# EAGLE design MySens-GWeasyRS485-Nano-V20-011 (EAGLE 7.6.0)
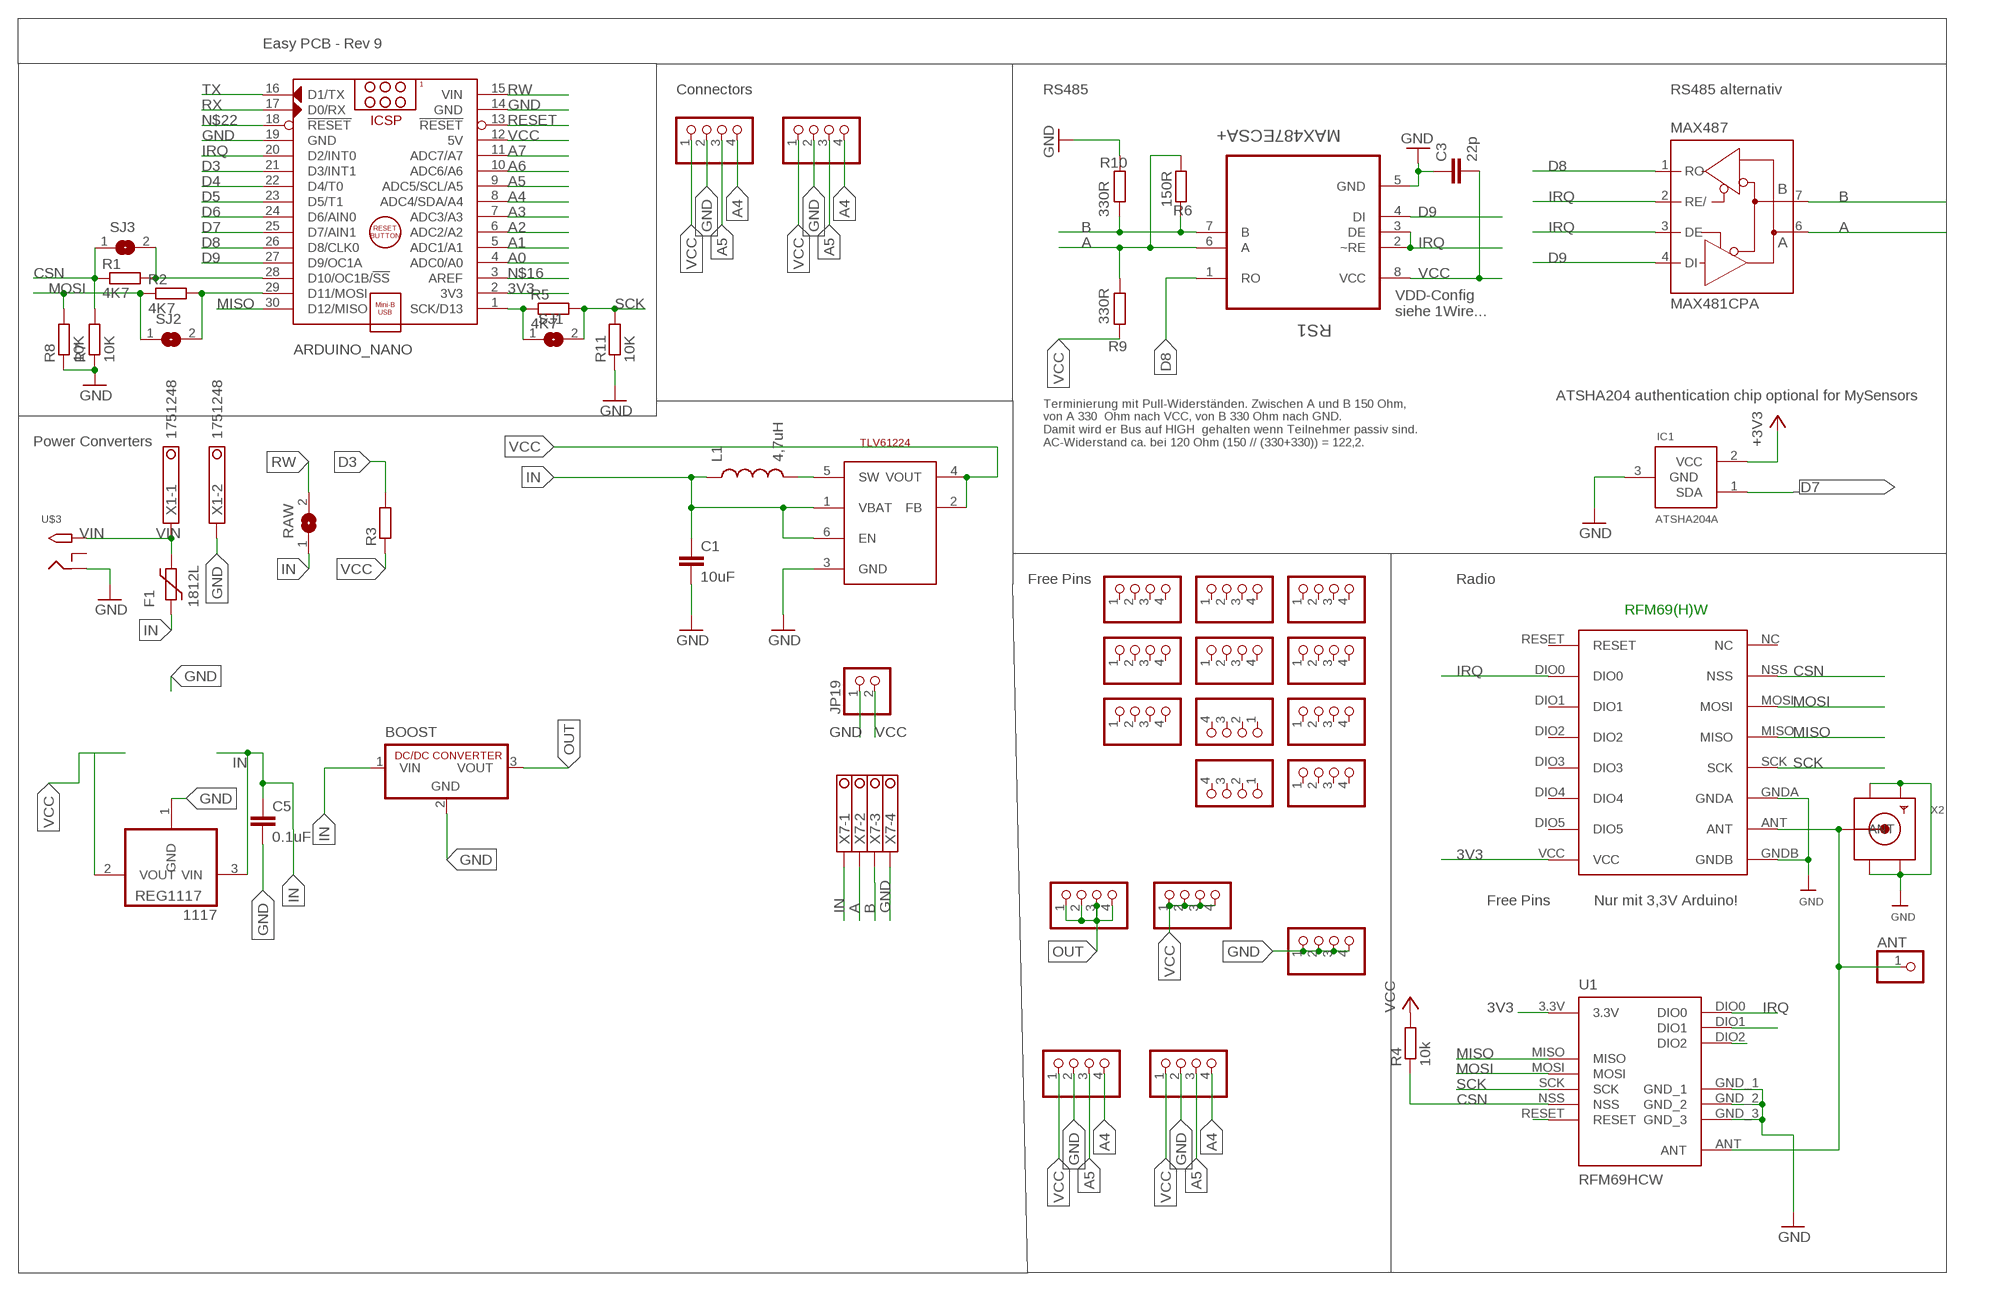
[diagram p0: schematic, sheet 1]

## Parts
1117  REG1117  [SOT223]
ANT  PINHD-1X1  [1X01]
ARDUINO_NANO  ARDUINO_NANO_OHNE-BOHR  [ARDUINO_NANO]
BOOST  R-78C1.8-1.0  [SIP3]
C1  10uF  CAP0805  [0805]
C3  22p  C-EUC0805  [C0805]
C5  0.1uF  C-EUC1206  [C1206]
F1  1812L  [1812L]
IC1  ATSHA204A  [SOT23]
JP1  PINHD-1X04_2.54-S  [1X04-S]
JP2  PINHD-1X04_2.54-S  [1X04-S]
JP3  PINHD-1X04_2.54-S  [1X04-S]
JP4  PINHD-1X04_2.54-S  [1X04-S]
JP5  PINHD-1X04_2.54-S  [1X04-S]
JP6  PINHD-1X04_2.54-S  [1X04-S]
JP7  PINHD-1X04_2.54-S  [1X04-S]
JP8  PINHD-1X04_2.54-S  [1X04-S]
JP9  PINHD-1X04_2.54-S  [1X04-S]
JP10  PINHD-1X04_2.54-S  [1X04-S]
JP11  PINHD-1X04_2.54-S  [1X04-S]
JP12  PINHD-1X04_2.54-S  [1X04-S]
JP13  PINHD-1X04_2.54-S  [1X04-S]
JP14  PINHD-1X04_2.54-S  [1X04-S]
JP15  PINHD-1X04_2.54-S  [1X04-S]
JP16  PINHD-1X04_2.54-S  [1X04-S]
JP17  PINHD-1X04_2.54-S  [1X04-S]
JP18  PINHD-1X04_2.54-S  [1X04-S]
JP19  PINHD-1X2  [1X02]
L1  4,7uH  INDUCTOR0805  [0805]
MAX487  MAX481CPA  [DIL08]
R1  4K7  R-EU_M0805  [M0805]
R2  4K7  R-EU_M0805  [M0805]
R3  R-EU_R0805  [R0805]
R4  10k  R-EU_M0805  [M0805]
R5  4K7  R-EU_M0805  [M0805]
R6  150R  R-EU_R0805  [R0805]
R7  10K  R-EU_M0805  [M0805]
R8  10K  R-EU_M0805  [M0805]
R9  330R  R-EU_R0805  [R0805]
R10  330R  R-EU_R0805  [R0805]
R11  10K  R-EU_M0805  [M0805]
RAW  SJ  [SJ]
RFM69W  RFM69HW  [RFM]
RS1  MAX487ECSA+  [SOIC127P600X175-8N]
SJ1  SJ  [SJ]
SJ2  SJ  [SJ]
SJ3  SJ  [SJ]
STEPUP  TLV61224  TI-TLV61224  [SOT23-6L]
U1  RFM69HCW  [RFM69HCW-XXXS2]
U$3  2.1MMJACKTHM  [PJ-102A]
X1  1751248  [1751248]
X2  SMACONNECTOR_EDGE  [SMA_EDGELAUNCH]
X7  1751264  [1751264]

## Nets
3V3: ARDUINO_NANO.2(3V3) IC1.2(VCC) RFM69W.VCC U1.3.3V ; supply symbol labelled +3V3
A: MAX487.6(A) R6.1 R9.2 RS1.6(A) X7.2
A0: ARDUINO_NANO.4(ADC0/A0)
A1: ARDUINO_NANO.5(ADC1/A1)
A2: ARDUINO_NANO.6(ADC2/A2)
A3: ARDUINO_NANO.7(ADC3/A3)
A4: ARDUINO_NANO.8(ADC4/SDA/A4) JP6.4 JP10.4 JP17.4 JP18.4
A5: ARDUINO_NANO.9(ADC5/SCL/A5) JP6.3 JP10.3 JP17.3 JP18.3
A6: ARDUINO_NANO.10(ADC6/A6)
A7: ARDUINO_NANO.11(ADC7/A7)
ANT: ANT.1 RFM69W.ANT U1.ANT X2.P(ANT)
B: MAX487.7(B) R6.2 R10.1 RS1.7(B) X7.3
CSN: R1.1 R4.1 R7.2 RFM69W.NSS SJ3.1 U1.NSS
D3: ARDUINO_NANO.21(D3/INT1) R3.2
D4: ARDUINO_NANO.22(D4/T0)
D5: ARDUINO_NANO.23(D5/T1)
D6: ARDUINO_NANO.24(D6/AIN0)
D7: ARDUINO_NANO.25(D7/AIN1) IC1.1(SDA)
D8: ARDUINO_NANO.26(D8/CLK0) MAX487.1(RO) RS1.1(RO)
D9: ARDUINO_NANO.27(D9/OC1A) MAX487.4(DI) RS1.4(DI)
GND [Power]: 1117.1(GND) ARDUINO_NANO.14(GND) ARDUINO_NANO.19(GND) BOOST.2(GND) C1.2 C3.1 C5.2 IC1.3(GND) JP1.1 JP1.2 JP1.3 JP1.4 JP6.2 JP10.2 JP17.2 JP18.2 JP19.1 R7.1 R8.1 R10.2 R11.1 RFM69W.GNDA RFM69W.GNDB RS1.5(GND) STEPUP.3(GND) U1.GND_1 U1.GND_2 U1.GND_3 U$3.RING X1.2 X2.GND@1(GND4) X2.GND@2(GND3) X2.GND@3(GND2) X2.GND@4(GND1) X7.4
IN [Power]: 1117.3(VIN) BOOST.1(VIN) C1.1 C5.1 F1.P$1 L1.1 RAW.1 STEPUP.1(VBAT) STEPUP.6(EN) X7.1
IRQ: ARDUINO_NANO.20(D2/INT0) MAX487.2(RE/) MAX487.3(DE) RFM69W.DIO0 RS1.2(~RE) RS1.3(DE) U1.DIO0
MISO: ARDUINO_NANO.30(D12/MISO) RFM69W.MISO U1.MISO
MOSI: R2.1 R8.2 RFM69W.MOSI SJ2.1 U1.MOSI
N$1: U1.RESET
N$2: ARDUINO_NANO.1(SCK/D13) R5.1 SJ1.1
N$3: ARDUINO_NANO.28(D10/OC1B/!SS) R1.2 SJ3.2
N$4: ARDUINO_NANO.29(D11/MOSI) R2.2 SJ2.2
N$13: L1.2 STEPUP.5(SW)
N$14: U1.DIO2
N$15: U1.DIO1
N$16: ARDUINO_NANO.3(AREF)
N$22: ARDUINO_NANO.18(!RESET)
OUT [Power]: BOOST.3(VOUT) JP13.1 JP13.2 JP13.3 JP13.4
RESET: ARDUINO_NANO.13(!RESET)
RW: ARDUINO_NANO.15(VIN) RAW.2
RX: ARDUINO_NANO.17(D0/RX)
SCK: R5.2 R11.2 RFM69W.SCK SJ1.2 U1.SCK
TX: ARDUINO_NANO.16(D1/TX)
VCC [Power]: 1117.2(VOUT) ARDUINO_NANO.12(5V) C3.2 JP3.1 JP3.2 JP3.3 JP3.4 JP6.1 JP10.1 JP17.1 JP18.1 JP19.2 R3.1 R4.2 R9.1 RS1.8(VCC) STEPUP.2(FB) STEPUP.4(VOUT)
VIN [Power]: F1.P$2 U$3.TIP X1.1
Unconnected: JP2.1 JP2.2 JP2.3 JP2.4 JP4.1 JP4.2 JP4.3 JP4.4 JP5.1 JP5.2 JP5.3 JP5.4 JP7.1 JP7.2 JP7.3 JP7.4 JP8.1 JP8.2 JP8.3 JP8.4 JP9.1 JP9.2 JP9.3 JP9.4 JP11.1 JP11.2 JP11.3 JP11.4 JP12.1 JP12.2 JP12.3 JP12.4 JP14.1 JP14.2 JP14.3 JP14.4 JP15.1 JP15.2 JP15.3 JP15.4 JP16.1 JP16.2 JP16.3 JP16.4 RFM69W.DIO1 RFM69W.DIO2 RFM69W.DIO3 RFM69W.DIO4 RFM69W.DIO5 RFM69W.NC RFM69W.RESET U$3.RING_SW

## Notes on the sheet
- Easy PCB - Rev 9
- Connectors | RS485 | RS485 alternativ
- VDD-Config
  siehe 1Wire...
- ATSHA204 authentication chip optional for MySensors
- Power Converters
- Terminierung mit Pull-Widerständen. Zwischen A und B 150 Ohm,
  von A 330  Ohm nach VCC, von B 330 Ohm nach GND. 
  Damit wird er Bus auf HIGH  gehalten wenn Teilnehmer passiv sind.
  AC-Widerstand ca. bei 120 Ohm (150 // (330+330)) = 122,2.
- Free Pins | Radio
- RFM69(H)W
- Free Pins | Nur mit 3,3V Arduino!

## Power pins joined to a net without a drawn wire
GND: MAX487.5(GND)
VCC: MAX487.8(VCC)

## Library data of the parts
1117 = burr-brown:REG1117: 800mA and 1A Low Dropout (LDO) Positive Regulator 1.8V, 2.5V, 2.85V, 3.3V, 5V, and Adj; MPN: REG1117; OC_FARNELL: 1097566; OC_NEWARK: 14P6981
ANT = pinhead:PINHD-1X1: PIN HEADER
ARDUINO_NANO = ArduinoNanoV30:ARDUINO_NANO_OHNE-BOHR: Arduino Nano V3.0 Module Overview: The Arduino Nano is a small, complete, and breadboard-friendly board based on the ATmega328 (Arduino Nano 3.x) or ATmega168 (Arduino Nano 2.x). It has more or less the same functionality of the Arduino Duemilanove, but in a different package. It lacks only a DC power jack, and works with a Mini-B USB cable instead of a standard one. The Nano was designed and is being produced by Gravitech <http://www.gravitech.us/arna30wiatp.html>. General specifications: Item Value Microcontroller Atmel ATmega168 or ATmega328 Operating Voltage (logic level) 5 V Input Voltage (recommended) 7-12 V Input Voltage (limits) 6-20 V Digital I/O Pins 14 (of which 6 provide PWM output) Analog Input Pins 8 DC Current per I/O Pin 40 mA Flash Memory 16 KB (ATmega168) or 32 KB (ATmega328) of which 2 KB used by bootloader SRAM 1 KB (ATmega168) or 2 KB (ATmega328) EEPROM 512 bytes (ATmega168) or 1 KB (ATmega328) Clock Speed 16 MHz Dimensions (Inches) 0.73" x 1.70" Dimensions (mm) 18mm x 45mm Overall height About 9 mm (not including pins) Weigth 5 g Power: The Arduino Nano can be powered via the Mini-B USB connection, 6-20V unregulated external power supply (pin 30), or 5V regulated external power supply (pin 27). The power source is automatically selected to the highest voltage source. Memory: The ATmega168 has 16 KB of flash memory for storing code (of which 2 KB is used for the bootloader); the ATmega328 has 32 KB, (also with 2 KB used for the bootloader). The ATmega168 has 1 KB of SRAM and 512 bytes of EEPROM (which can be read and written with the EEPROM library); the ATmega328 has 2 KB of SRAM and 1 KB of EEPROM. Input and Output: Each of the 14 digital pins on the Nano can be used as an input or output, using pinMode(), digitalWrite(), and digitalRead() functions. They operate at 5 volts. Each pin can provide or receive a maximum of 40 mA and has an internal pull-up resistor (disconnected by default) of 20-50 kOhms. In addition, some pins have specialized functions. Visit Arduino - ArduinoBoardNano <https://www.arduino.cc/en/Main/ArduinoBoardNano>
BOOST = dc-dc-converter:R-78C*-1.0: INNOLINE DC/DC-Converter 1.0 AMP SIP3 Single Output Source: Data sheet <http://www.mikrocontroller.net/attachment/150645/157764-da-01-en-DC_DC_WANDLER_R_78C5_0_1_0.pdf>
C1 = SparkFun-Passives:CAP: Capacitor Standard 0603 ceramic capacitor, and 0.1" leaded capacitor.
C3 C5 = rcl:C-EU: CAPACITOR, European symbol
F1 = ptc-littlefuse:1812L
IC1 = Sensor:ATSHA204A
JP1-JP18 = pinhead-2:PINHD-1X04: PIN HEADER
JP19 = pinhead:PINHD-1X2: PIN HEADER
L1 = SparkFun-Passives:INDUCTOR: Inductors Basic Inductor/Choke - 0603 and 1206. Footprints are not proven and vary greatly between part numbers.
MAX487 = maxim-4:MAX481CPA: RS485 TRANSEIVER
R1-R11 = rcl:R-EU_: RESISTOR, European symbol
RAW SJ1-SJ3 = jumper:SJ: SMD solder JUMPER
RFM69W = hoperf:RFM69HW
RS1 = Maxim_By_element14_Batch_1:MAX487ECSA+: Low-Power, Slew-Rate-Limited RS-485/RS-422 Transceivers; MPN: MAX487ECSA+; OC_FARNELL: 9724532; OC_NEWARK: 68K4803; PACKAGE: SOIC-8; SUPPLIER: Maxim
STEPUP = TLV61224:TI-TLV61224
U1 = doug:RFM69H
U$3 = adafruit:2.1MMJACK: 2.1mm x 5.5mm THM DC jack with internal switch. Digikey part #PJ-102A, 4UCON part #05537 2.1mm x 5.5mm SMT DC jack with internal switch. Digikey part #PJ-002A-SMT, 4UCON part #03267 By microbuilder.eu & adafruit.com
X1 = con-phoenix-350:1751248: MKDS 1/ 2-3,5 Printklemme Nennstrom: 10 A Bemessungsspannung: 160 V Raster: 3,5 mm Polzahl: 2 Montageart: Löten Anschlussart: Schraubanschluss Anschlussrichtung vom Leiter zur Platine: 0° Source: http://eshop.phoenixcontact.com .. 1751248.pdf; OC_FARNELL: unknown; OC_NEWARK: unknown
X2 = adafruit:SMACONNECTOR: SMA Connector 90° DIP SMA Connector, 50 Ohm (4UConnector: 07259)
X7 = con-phoenix-350:1751264: MKDS 1/ 4-3,5 Printklemme Nennstrom: 10 A Bemessungsspannung: 160 V Raster: 3,5 mm Polzahl: 4 Montageart: Löten Anschlussart: Schraubanschluss Anschlussrichtung vom Leiter zur Platine: 0° Source: http://eshop.phoenixcontact.com .. 1751264.pdf; MPN: 1751264; OC_FARNELL: unknown; OC_NEWARK: 10R0934

## Net classes
0 default: width 0.305 mm
1 Power: width 0.508 mm

## Board
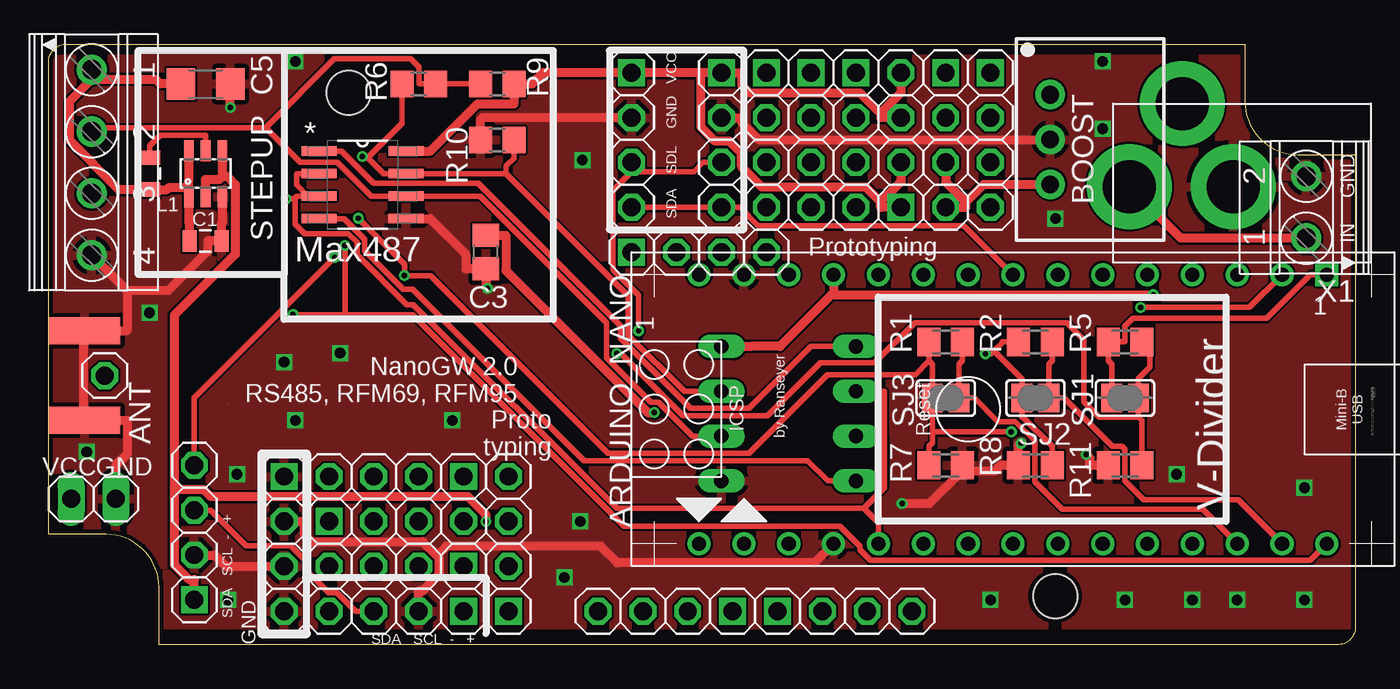
[diagram p1: board, top side]
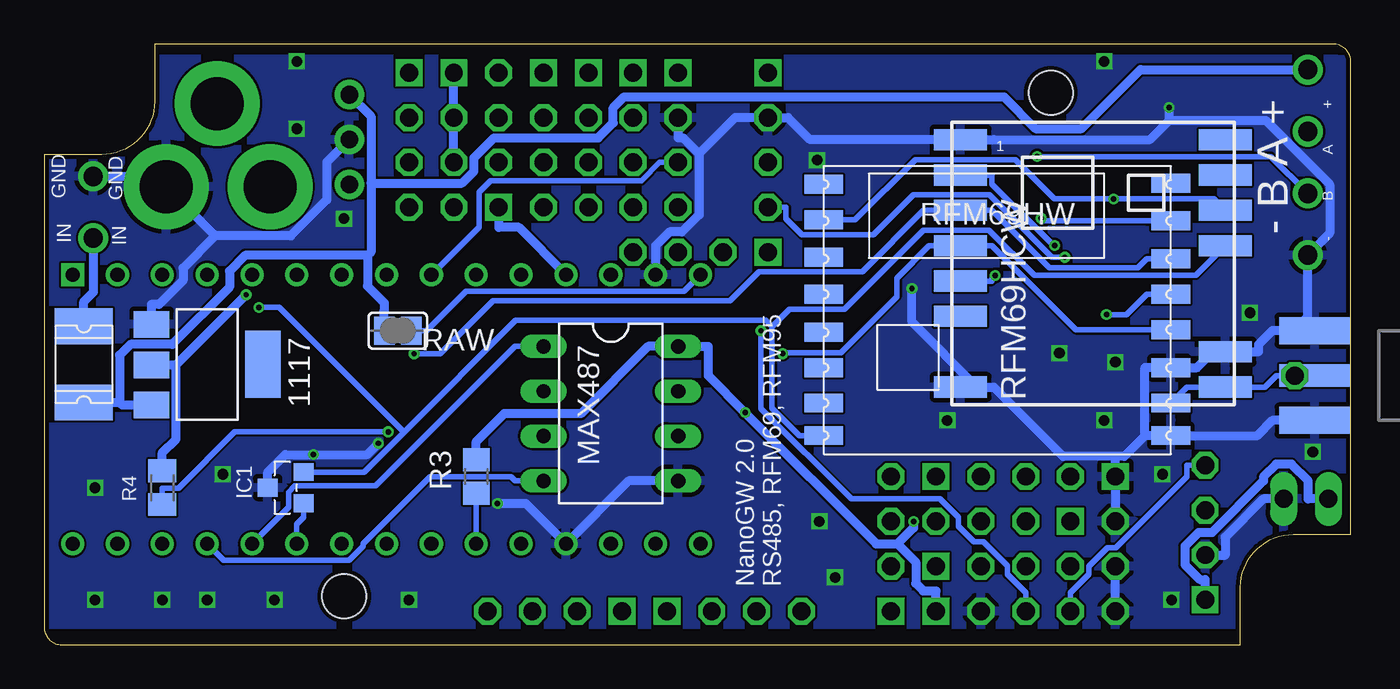
[diagram p2: board, bottom side, seen from below]

Size 74 x 34 mm. Coordinates in mm from the lower left corner, seen from the top.
Outline: 0,6.25 0,33 arc-90 1,34 67.75,34 67.75,30.75 arc90 70.75,27.75 74,27.75 74,1 arc-90 73,0 6.25,0 6.25,3.25 arc90 3.25,6.25 0,6.25
Copper layers (1*16): Top 0.035mm / dielectric 1.5mm / Bottom 0.035mm
Design rules "dirt_cheap_dirty_boards.v1": minimum track width 5mil, minimum drill 12mil, track to track 5mil, track to pad 5mil, pad to pad 5mil, via to via 5mil, smd to smd 0mil, copper to edge 10mil, drill to drill 10mil, minimum pad ring 10mil, minimum via ring 6mil, stop-mask expansion 2mil, vias tented up to drill 25mil, thermal gap 10mil
Holes 2.5 mm at 57,2.75 17,31.25
tRestrict: area 0.6,33.7 to 67.9,34.3; area 6.3,0 to 74.3,0.6
bRestrict: area 0.6,33.7 to 67.9,34.3; area 6.3,0 to 74.3,0.6

### Footprints (pad centres in the part's own frame; a part is rotated, then mirrored left to right if it is on the bottom)
SOT223 = smd 1.499 x 2.007: 1 -2.261,-3.15; 2 0.025,-3.15; 3 2.311,-3.15 | smd 3.81 x 2.007: 4 0,3.15
1X01 = drill 1.016 octagon: 1 0,0
ARDUINO_NANO = drill 0.8 square: 1 -20.32,-7.62 | drill 0.8: 2 -17.78,-7.62; 3 -15.24,-7.62; 4 -12.7,-7.62; 5 -10.16,-7.62; 6 -7.62,-7.62; 7 -5.08,-7.62; 8 -2.54,-7.62; 9 0,-7.62; 10 2.54,-7.62; 11 5.08,-7.62; 12 7.62,-7.62; 13 10.16,-7.62; 14 12.7,-7.62; 15 15.24,-7.62; 16 15.24,7.62; 17 12.7,7.62; 18 10.16,7.62; 19 7.62,7.62; 20 5.08,7.62; 21 2.54,7.62; 22 0,7.62; 23 -2.54,7.62; 24 -5.08,7.62; 25 -7.62,7.62; 26 -10.16,7.62; 27 -12.7,7.62; 28 -15.24,7.62; 29 -17.78,7.62; 30 -20.32,7.62
SIP3 = drill 1 pad 1.676: 1 -2.54,0; 2 0,0; 3 2.54,0
0805 = smd 0.8 x 1.2: 1 -0.9,0; 2 0.9,0
C0805 = smd 1.3 x 1.5: 1 -0.95,0; 2 0.95,0
C1206 = smd 1.6 x 1.8: 1 -1.4,0; 2 1.4,0
1812L = smd 2.03 x 3.3: P$1 -2.16,0; P$2 2.16,0
SOT23 = smd 1.016 x 1.143: 1 -0.889,-1.016; 2 0.889,-1.016; 3 0,1.016
1X04-S = drill 1.016 square: 1 -3.81,0 | drill 1.016 octagon: 2 -1.27,0; 3 1.27,0; 4 3.81,0
1X02 = drill 1.016 long: 1 -1.27,0; 2 1.27,0
DIL08 = drill 0.813 long: 1 -3.81,-3.81; 2 -1.27,-3.81; 3 1.27,-3.81; 4 3.81,-3.81; 5 3.81,3.81; 6 1.27,3.81; 7 -1.27,3.81; 8 -3.81,3.81
M0805 = smd 1.3 x 1.6: 1 -0.95,0; 2 0.95,0
R0805 = smd 1.3 x 1.5: 1 -0.95,0; 2 0.95,0
SJ = smd 1.168 x 1.6: 1 -0.762,0; 2 0.762,0
RFM = smd 2.184 x 1.067: ANT 19.651,2.889; DIO0 0,13.27; DIO1 0,11.143; DIO2 0,9.047; DIO3 0,6.889; DIO4 0,4.889; DIO5 0,2.889; GNDA 19.651,4.889; GNDB 19.651,1.048; MISO 19.651,9.047; MOSI 19.651,11.047; NC 19.651,15.334; NSS 19.651,13.206; RESET 0,15.27; SCK 19.651,7.048; VCC 0,1.048
SOIC127P600X175-8N = smd 1.981 x 0.533: 1 -2.464,1.905; 2 -2.464,0.635; 3 -2.464,-0.635; 4 -2.464,-1.905; 5 2.464,-1.905; 6 2.464,-0.635; 7 2.464,0.635; 8 2.464,1.905
SOT23-6L = smd 0.55 x 1.2: 1 -0.95,-1.3; 2 0,-1.3; 3 0.95,-1.3; 4 0.95,1.3; 5 0,1.3; 6 -0.95,1.3
RFM69HCW-XXXS2 = smd 3 x 1.2: 3.3V 7.5,1; ANT 7.5,-7; DIO0 7.5,3; DIO1 7.5,5; DIO2 7.5,7; GND_1 7.5,-5; GND_2 -7.5,-7; GND_3 -7.5,7; MISO -7.5,5; MOSI -7.5,3; NSS -7.5,-1; RESET -7.5,-3; SCK -7.5,1
PJ-102A = drill 3 pad 4.8: RING 0.1,-3.39; RING_SW -4.6,-6.29; TIP 0.1,-9.29
1751248 = drill 1.1 pad 1.7: 1 -1.75,-0.1; 2 1.75,-0.1
SMA_EDGELAUNCH = smd 4.064 x 1.524: GND@1 2.032,-2.54; GND@2 2.032,2.54 | smd 4.064 x 1.524 bottom: GND@3 2.032,2.54; GND@4 2.032,-2.54 | smd 4.064 x 1.27: P 2.032,0
1751264 = drill 1.1 pad 1.7: 1 -5.25,-0.1; 2 -1.75,-0.1; 3 1.75,-0.1; 4 5.25,-0.1

### Placement (x,y rotation side)
1117  64.77,15.88 270 bottom
ANT  3.17,15.24 0 top
ARDUINO_NANO  52.07,13.34 180 top
BOOST  56.72,28.6 270 top
C1  8.89,22.86 0 top
C3  24.77,22.23 90 top
C5  8.89,31.75 0 top
F1  71.75,15.88 90 bottom
IC1  60.33,8.89 90 bottom
JP1  13.34,5.71 270 top
JP2  45.09,1.91 0 top
JP3  48.26,28.57 90 top
JP4  19.68,9.53 180 top
JP5  19.68,6.99 0 top
JP6  33.02,28.57 270 top
JP7  19.68,4.45 180 top
JP8  26.04,5.71 90 top
JP9  34.92,1.91 180 top
JP10  38.1,28.57 270 top
JP11  53.34,28.57 270 top
JP12  43.18,28.57 270 top
JP13  50.8,28.57 270 top
JP14  36.83,22.23 0 top
JP15  40.64,28.57 270 top
JP16  45.72,28.57 270 top
JP17  8.26,6.35 90 top
JP18  19.68,1.91 180 top
JP19  2.54,8.26 180 top
L1  5.71,26.67 90 top
MAX487  41.91,13.08 270 bottom
R1  50.8,17.14 0 top
R2  55.88,17.14 0 top
R3  49.53,9.53 270 bottom
R4  67.31,8.89 90 bottom
R5  60.96,17.14 0 top
R6  20.95,31.75 180 top
R7  50.8,10.16 180 top
R8  55.88,10.16 0 top
R9  25.4,31.75 180 top
R10  25.4,28.57 180 top
R11  60.96,10.16 0 top
RAW  53.98,17.78 0 bottom
RFM69W  29.84,10.79 0 bottom
RS1  17.78,26.04 0 top
SJ1  60.96,13.97 0 top
SJ2  55.88,13.97 0 top
SJ3  50.8,13.97 0 top
STEPUP  8.89,26.67 0 top
U1  14.61,21.59 0 bottom
U$3  70.48,26.04 270 top
X1  71.12,24.77 90 top
X2  0,15.24 180 bottom
X7  2.54,27.3 270 top

### Tracks (layer width: path | path; a pad name or v marks a point on that pad's centre or on a via)
3V3  (via drill 0.3 pad 0.61)
  Top 0.305: ARDUINO_NANO.2 67.99,19.09 v61.84,19.09
  Bottom 0.305: 53.63,12.02 55.87,9.78 IC1.2 | 32.77,18.02 33.12,18.36 47.29,18.36 53.63,12.02 | v61.84,19.09 60.7,19.09 53.63,12.02 | 32.77,18.02 32.77,13.4 31.22,11.84 RFM69W.VCC | U1.3.3V 8.78,20.92 17.94,20.92 20.49,23.47 24.2,23.47 28.67,19 31.79,19 32.77,18.02
A
  Top 0.305: 12.3,29.28 14.25,27.33 16.34,27.33 18.27,25.4 RS1.6 21.51,25.4 24.43,25.4 31.59,18.24 31.59,16.24 34.1,13.73 34.54,13.73 36.46,11.81 36.5,11.81 MAX487.6 | X7.2 2.67,29.28 12.3,29.28 | 12.3,29.28 16.18,33.16 20.49,33.16 20.98,32.68 20.98,31.75 R6.1 R9.2
A4  (via drill 0.3 pad 0.61)
  Top 0.305: ARDUINO_NANO.8 51.84,23.72 40.18,23.72 39.14,24.77 JP10.4 JP6.4 | JP17.4 8.26,13.99 v16.2,21.94
  Bottom 0.305: v16.2,21.94 16.94,21.94 20.47,25.47 24.78,25.47 27.05,23.21 31.08,23.21 31.98,24.11 31.98,24.77 JP6.4 | JP17.4 9.3,10.16 9.3,9.5 13.3,5.49 13.79,5.49 14.83,4.45 14.83,3.99 15.88,2.95 JP18.4
A5  (via drill 0.3 pad 0.61)
  Top 0.305: v33.41,17.77 33.41,19.79 31.97,21.23 31.97,25.74 33.02,26.78 | JP10.3 37.06,27.3 36.54,26.78 33.02,26.78 | JP6.3 33.02,26.78 | JP18.3 18.25,1.91 17.89,1.91 17.37,1.91 16.33,2.95 15.86,2.95 14.61,4.2 14.61,4.71 13.7,5.61 11.2,5.61 9.19,7.62 JP17.3
  Bottom 0.305: JP18.3 18.41,2.95 19.46,3.99 19.46,4.47 20.82,5.84 21.35,5.84 22.23,6.71 22.23,7.21 23.27,8.26 28.29,8.26 33.41,13.37 v33.41,17.77 | JP10.3 39.14,27.3 40.18,26.26 48.72,26.26 49.38,25.6 49.38,23.65 ARDUINO_NANO.9
ANT  (1 unrouted)
  Bottom 0.305: RFM69W.ANT 9.29,14.59 U1.ANT 4.87,14.59 4.22,15.24 ANT.1 X2.P
B  (via drill 0.3 pad 0.61)
  Top 0.305: 18.12,27.64 v17.77,27.64 | 25.92,26.67 32.82,19.77 32.82,17.53 36,14.35 36.5,14.35 MAX487.7 | R6.2 20,29.52 18.12,27.64 | 18.12,27.64 18.12,27.52 18.97,26.67 RS1.7 21.51,26.67 25.92,26.67 | 25.92,26.67 25.92,27.11 26.35,27.55 R10.1
  Bottom 0.305: X7.3 4.52,27.64 v17.77,27.64
CSN  (via drill 0.3 pad 0.61)  (1 unrouted)
  Top 0.305: 50.04,12.05 v54.52,12.05 | 50.04,12.05 50.04,11.43 49.85,11.24 R7.2 | 50.04,12.05 SJ3.1 50.04,15.88 49.85,16.07 | v17.54,24.14 20.15,21.53 v20.15,20.9 21.64,20.9 31.69,10.85 39.67,10.85 44.11,15.29 49.08,15.29 49.85,16.07 | R1.1 49.85,16.07
  Bottom 0.305: v54.52,12.05 63.2,12.05 66.38,8.87 67.31,8.87 R4.1 | v17.54,24.14 17.39,24 11.56,24 RFM69W.NSS | U1.NSS 20.33,20.59 20.33,20.73 v20.15,20.9
D3
  Bottom 0.305: R3.2 ARDUINO_NANO.21
D7
  Bottom 0.305: IC1.1 59.31,7.21 59.69,6.83 ARDUINO_NANO.25
D8
  Top 0.305: MAX487.1 43.17,16.89 39.67,13.39 36.34,13.39 32.38,17.35 32.38,18.07 24.32,26.12 18.4,26.12 16.59,27.94 RS1.1
  Bottom 0.305: MAX487.1 47.32,16.89 55.22,8.99 59.8,8.99 60.16,8.63 60.16,7.79 ARDUINO_NANO.26
D9
  Top 0.305: MAX487.4 44.12,9.27 42.98,10.41 30.33,10.41 20.62,20.12 20.07,20.12 17.89,22.3 17.89,22.96 16.72,24.13 16.59,24.13 RS1.4
  Bottom 0.305: MAX487.4 47.32,9.27 47.55,9.51 52.14,9.51 55.94,5.71 55.94,5.58 56.74,4.78 63.84,4.78 ARDUINO_NANO.27
GND  (via drill 0.3 pad 0.61, 0.6)
  Top 0.508: 4.45,20.05 6.79,20.05 9.01,22.27 9.01,22.86 C1.2 9.79,23.33 9.79,23.84 9.84,23.89 STEPUP.3 | 4.45,20.05 4.45,17.78 X2.GND@1 1.97,17.72 1.97,12.76 X2.GND@2 4.45,12.7 4.45,10.79 3.81,10.16 JP19.1 | X7.4 4.45,20.05 | R10.2 24.45,29.71 24.59,29.84 JP6.2 | v10.29,30.41 C5.2 | v48.33,8 49.89,8 51.75,9.87 | v55.07,11.41 55.01,11.34 54.93,11.34 R8.1 53.9,10.16 53.6,9.87 51.75,9.87 | 21.99,5.04 22.13,4.91 22.13,3.98 21.19,3.05 20.95,3.05 JP18.2 | 21.99,5.04 21.19,5.84 14.91,5.84 14.48,6.27 14.48,6.99 JP1.2 | ARDUINO_NANO.19 43.38,4.64 32.21,4.64 31.26,5.59 22.53,5.59 21.99,5.04 | v24.86,20.17 24.79,20.24 24.77,20.24 C3.1 23.63,21.27 23.63,22.11 21.62,24.13 RS1.5 | R7.1 51.75,9.87 | R11.1 58.98,10.16 58.98,10.54 v58.75,10.77 | JP10.2 39.24,29.84 39.24,29.56 40.2,28.6 BOOST.2 | JP17.2 9.4,5.08 10.03,4.45 JP1.3
  Bottom 0.508: 10.29,29.69 v10.29,30.41 | 10.29,29.69 4.83,29.69 1.2,26.07 1.2,23.3 X7.4 2.44,18.58 3.24,17.78 | 10.29,29.69 11.39,28.59 20.22,28.59 U1.GND_3 23.99,28.59 30.62,28.59 31.88,29.84 32.45,29.84 JP6.2 34.87,29.84 36.91,27.8 | v48.33,8 46.74,8 ARDUINO_NANO.19 40.89,9.27 MAX487.5 | 64.31,23.15 U$3.RING 67.67,26.52 X1.2 | BOOST.2 57.99,27.33 57.99,25.19 60.03,23.15 64.31,23.15 | 64.31,23.15 66.14,21.33 66.14,20.63 67.5,19.27 67.92,19.27 1117.1 | v55.07,11.41 55.71,10.77 v58.75,10.77 60.35,10.77 61.34,9.78 IC1.3 | JP1.2 JP1.1 13.34,10.1 13.34,10.67 | 21.16,14.59 24.86,18.28 v24.86,20.17 | 21.16,14.59 20.22,14.59 16.3,10.67 13.34,10.67 | U1.GND_2 21.16,14.59 | 3.24,17.78 4.45,17.78 5.22,17 5.22,16.59 U1.GND_1 7.81,16.59 8.72,15.68 RFM69W.GNDA 11.67,15.68 11.67,11.84 | X2.GND@1 3.24,17.78 | JP17.2 7.11,5.08 7.11,6.1 4.95,8.26 JP19.1 | 36.91,27.8 36.91,24.33 37.88,23.37 38.6,23.37 39.37,22.6 ARDUINO_NANO.14 | 36.91,27.8 37.81,28.7 38.1,28.7 JP10.2 | 11.67,11.84 12.84,10.67 13.34,10.67 | 13.34,10.67 | 11.67,11.84 RFM69W.GNDB 5.3,11.84 4.45,12.7 X2.GND@2 | JP1.4 JP1.3
  other vias: 13.97,12.7 22.86,12.7 10.16,2.54 29.21,3.81 59.69,33.02 59.69,29.21 53.34,2.54 60.96,2.54 64.77,2.54 71.12,2.54 67.31,2.54 71.12,8.89 16.51,16.51 13.97,33.02 5.71,18.8 13.34,16 10.67,9.65 30.1,6.99 63.88,9.65 57.02,24.13 30.23,27.43 2.16,10.92
  pour Top: 0,34.29 73.66,34.29 73.66,0 0,0
  pour Bottom: 73.66,0 73.66,34.29 0,34.29 0,0
IN
  Top 0.508: 2.44,32 6.06,32 6.31,31.75 C5.1 | 2.44,32 1.2,30.77 1.2,28.55 3.98,25.77 L1.1 6.21,25.77 6.7,25.77 6.79,25.86 7.94,25.86 | 2.44,32 X7.1 | 7.94,25.86 7.94,26.35 7.94,26.99 STEPUP.6 | 7.94,25.86 STEPUP.1 7.94,23.89 7.99,23.84 C1.1
  Bottom 0.508: 55.49,26.13 50.33,26.13 49.66,26.81 49.66,27.56 48.51,28.7 42.63,28.7 41.78,29.55 41.78,30.39 41.16,31.01 19.65,31.01 17.86,29.23 15.25,29.23 11.92,32.55 X7.1 | 55.49,26.13 55.49,22.23 55.69,22.04 | BOOST.1 55.49,29.92 55.49,26.13 | 55.69,22.04 55.69,20.31 54.74,19.36 54.74,18.96 RAW.1 | 55.69,22.04 62.62,22.04 63.5,21.16 63.5,20.25 66.74,17 69.11,17 69.72,16.39 69.72,13.71 | F1.P$1 69.72,13.71 | 1117.3 69.57,13.56 69.72,13.71
IRQ  (via drill 0.3 pad 0.61)
  Top 0.305: 46.16,7.72 46.99,6.89 ARDUINO_NANO.20 | 13.96,25.24 13.96,23.81 14.49,23.28 16.96,23.28 17.46,22.78 17.46,22.07 20.27,19.26 20.65,19.26 32.19,7.72 46.16,7.72 | 47.32,11.81 47.32,8.88 46.16,7.72 | 47.32,11.81 47.21,11.81 MAX487.3 | MAX487.2 47.32,14.35 47.32,11.81 | 13.96,25.24 13.96,25.31 14.05,25.4 14.68,25.4 | 13.96,25.24 v13.44,25.24 | RS1.2 14.05,26.67 14.05,26.04 14.68,25.4 | RS1.3 14.68,25.4
  Bottom 0.305: RFM69W.DIO0 28.08,24.07 24.67,27.47 19.01,27.47 16.78,25.24 v13.44,25.24 7.76,25.24 U1.DIO0
MISO  (via drill 0.3 pad 0.61)  (1 unrouted)
  Top 0.305: 16.8,18.69 16.8,22.58 v16.78,22.61 | ARDUINO_NANO.30 71.46,4.78 46.54,4.78 45.94,5.38 45.94,5.57 44.81,6.71 32.59,6.71 20.61,18.69 16.8,18.69 | 16.8,18.69 v13.84,18.69
  Bottom 0.305: v16.78,22.61 16.86,22.61 20.33,26.07 20.33,26.59 U1.MISO | RFM69W.MISO 11.56,19.84 12.72,18.69 v13.84,18.69
MOSI  (via drill 0.3 pad 0.61)  (1 unrouted)
  Top 0.305: 53.53,16.64 54,17.11 54,17.14 R2.1 | v53.05,16.48 53.37,16.48 53.53,16.64 | 53.53,16.64 55.12,15.05 SJ2.1 55.12,12.89 55.18,12.89 56.83,11.24 R8.2
  Bottom 0.305: RFM69W.MOSI 11.56,21.84 12.06,21.35 17.09,21.35 20.33,24.59 U1.MOSI 24.2,24.59 27.66,21.12 33.51,21.12 35.16,19.48 48.57,19.48 51.57,16.48 v53.05,16.48
N$2
  Top 0.305: SJ1.1 60.2,15.88 60.01,16.07 R5.1 60.94,17.14 60.94,18.02 61.39,18.47 68.98,18.47 71.46,20.95 ARDUINO_NANO.1
N$3
  Top 0.305: ARDUINO_NANO.28 65.35,7.68 57.42,7.68 55.86,9.23 55.86,11.54 54.76,12.64 53.76,12.64 52.43,13.97 SJ3.2 51.56,15.88 51.75,16.07 R1.2
N$4
  Top 0.305: ARDUINO_NANO.29 67.36,8.2 62.02,8.2 60.94,9.28 60.94,11.08 60.78,11.24 60.24,11.24 57.51,13.97 SJ2.2 56.64,15.88 56.83,16.07 R2.2
N$13
  Top 0.305: L1.2 5.71,28.25 6.32,28.85 8.89,28.85 STEPUP.5
OUT
  Top 0.508: 51.94,25.05 52.95,26.06 BOOST.3 | 51.94,25.05 51.94,24.77 JP13.4 | 51.94,25.05 50.83,26.16 50.8,26.16 JP13.3
  Bottom 0.508: JP13.1 JP13.2 JP13.3
RW
  Bottom 0.305: ARDUINO_NANO.15 37.77,20.01 50.12,20.01 52.35,17.78 RAW.2
SCK  (via drill 0.3 pad 0.61)  (1 unrouted)
  Top 0.305: v32.18,16.48 32.4,16.48 35.93,12.96 40.72,12.96 43.72,15.95 46.77,15.95 49.05,18.23 57.67,18.23 58.63,17.27 58.63,13.75 59.49,12.89 61.72,12.89 | 61.72,12.89 61.72,13 SJ1.2 61.72,15.05 62.38,15.7 62.38,17.14 R5.2 | 61.72,12.89 61.91,12.7 R11.2
  Bottom 0.305: v32.18,16.48 32.11,16.54 28.88,16.54 25.71,19.71 25.71,20.76 23.88,22.59 23,22.59 U1.SCK 20.33,22.59 15.58,17.84 RFM69W.SCK
VCC  (via drill 0.3 pad 0.61)
  Top 0.508: 9.84,26.52 10.11,26.52 10.57,26.05 10.57,22.1 7.11,18.64 7.11,8.78 | 9.84,26.52 9.67,26.35 8.89,26.35 STEPUP.2 | 9.84,26.52 9.84,26.99 STEPUP.4 | 7.11,8.78 7.11,4.54 7.97,3.68 8.26,3.68 JP17.1 | v24.77,6.97 24.77,7.37 23.75,8.38 9.18,8.38 8.78,8.78 7.11,8.78 | 44.45,19.92 44.56,19.81 v62.56,19.81 | 44.45,19.92 41.42,16.89 39.8,16.89 MAX487.8 | ARDUINO_NANO.12 44.45,19.92 | 47.11,30.09 47.12,30.08 47.12,29.84 JP3.3 | 47.11,30.09 45.96,31.24 39.67,31.24 39.24,31.67 39.24,32.38 JP10.1 36.95,32.38 | 47.11,30.09 48.26,31.24 JP3.4 | v34.3,13.15 33.93,13.15 25.9,21.18 25.9,23.18 C3.2 | RS1.8 21.62,27.94 24.29,30.62 26.35,30.62 R9.1 27.38,31.75 28.02,32.38 JP6.1 36.95,32.38 | 47.12,25.08 46.29,25.91 40.4,25.91 39.24,27.07 39.24,27.81 38.54,28.51 37.74,28.51 36.95,29.3 36.95,32.38 | 47.12,25.08 47.12,24.77 JP3.1 | 47.12,25.08 48.2,26.16 48.26,26.16 JP3.2
  Bottom 0.508: 66.53,15.85 v62.56,19.81 | R4.2 67.31,10.87 66.53,11.65 66.53,15.85 | 1117.2 66.53,15.85 | 25.67,5.71 24.64,4.68 24.64,3.48 24.21,3.05 23.5,3.05 JP18.1 | 25.67,5.71 26.87,5.71 v34.3,13.15 36.4,15.24 36.4,16.89 MAX487.8 39.8,16.89 43.6,13.09 47.95,13.09 49.53,11.51 R3.1 | v24.77,6.97 24.77,6.62 25.67,5.71 | JP3.1 48.26,23.62 47.12,23.62 ARDUINO_NANO.12 | JP17.1 8.26,3.68 8.54,3.68 9.4,4.54 9.4,5.58 8.63,6.35 7.87,6.35 4.95,9.27 4.95,9.5 4.23,10.22 3.36,10.22 2.41,9.27 2.41,8.26 JP19.2
VIN
  Top 0.508: X1.1 64.11,23.02 U$3.TIP
  Bottom 0.508: X1.1 71.22,19.97 71.75,19.43 F1.P$2

### Text on the board
tPlace: by Ranseyer
tNames: VCC | GND | GND | SDL | SDA | IN | Max487 | Prototyping | NanoGW 2.0 / RS485, RFM69, RFM95 | Proto / typing | VCC | GND | V-Divider | GND | SDA SCL - + | SDA SCL - +
bNames: GND | GND | IN | - B A + | - B A + | IN | RFM69HCW | NanoGW 2.0 / RS485, RFM69, RFM95
Document: Case: Hammond 1551K